# EAGLE design SimpleAmp-01 (EAGLE 4.15)
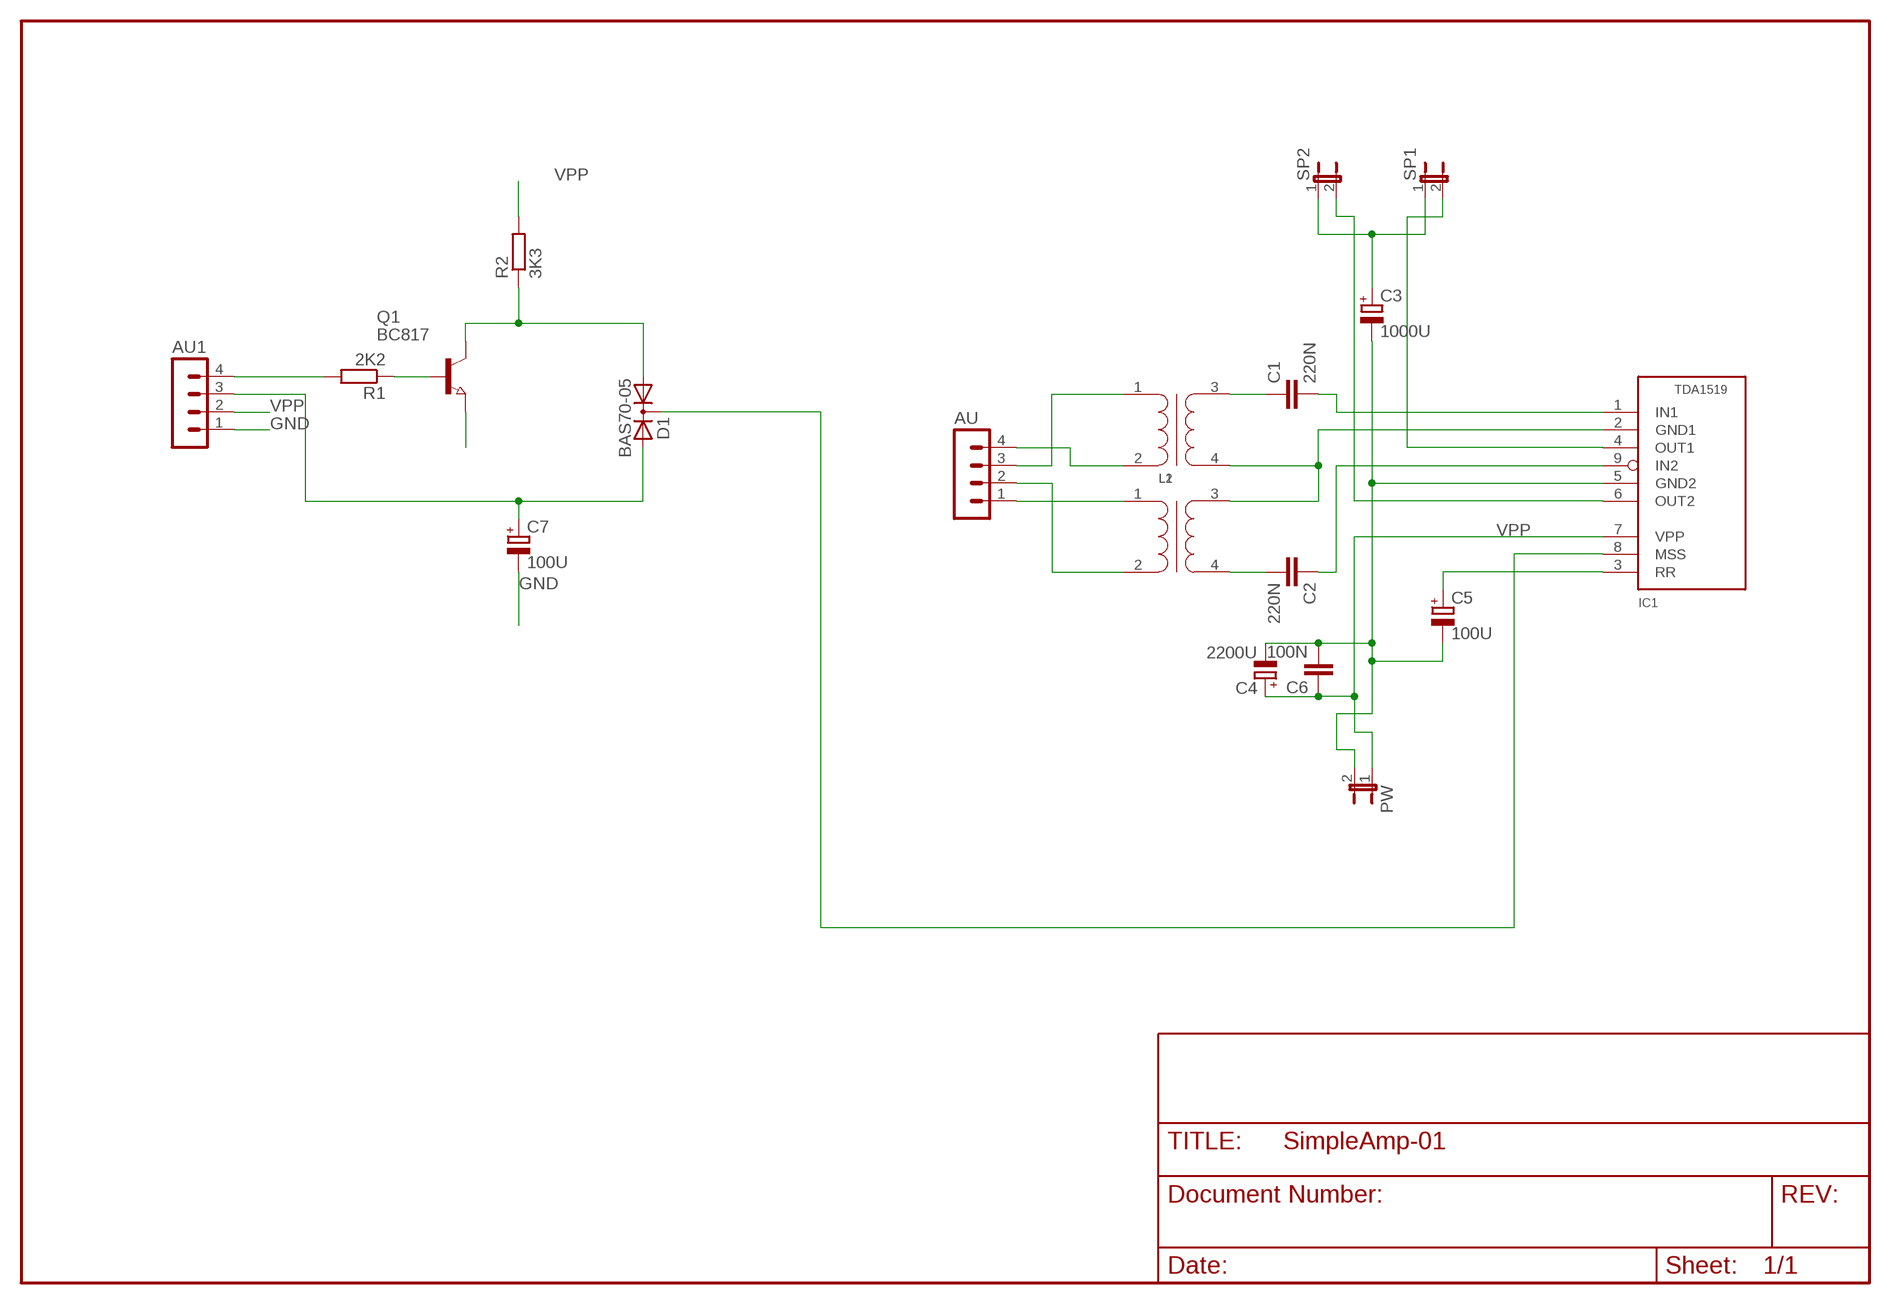
[diagram p0: schematic, sheet 1]

## Parts
AU  MA04-1  [MA04-1]
AU1  MA04-1  [MA04-1]
C1  220N  C-EU050-025X075  [C050-025X075]
C2  220N  C-EU050-025X075  [C050-025X075]
C3  1000U  CPOL-EUTT5D11  [TT5D11]
C4  2200U  CPOL-EUTT5D11  [TT5D11]
C5  100U  CPOL-EUE2.5-6  [E2,5-6]
C6  100N  C-EU025-024X044  [C025-024X044]
C7  100U  CPOL-EUSMCB  [SMC_B]
D1  BAS70-05  [SOT23]
IC1  TDA1519  [SIL09C]
L1  AUDIOUEBERTRAGER  [AUDIOUEBERTRAGER1]
L2  AUDIOUEBERTRAGER  [AUDIOUEBERTRAGER1]
PW  JP1E  [JP1]
Q1  BC817  NPN-TRANSISTOR_SOT23  [SOT23]
R1  2K2  R-EU_R0805  [R0805]
R2  3K3  R-EU_R0805  [R0805]
SP1  JP1E  [JP1]
SP2  JP1E  [JP1]

## Nets
AGND: IC1.2(GND1) L1.4 L2.3
GND: AU1.1 C3.- C4.- C5.- C6.2 C7.- IC1.5(GND2) PW.2 Q1.2(E)
MSS: D1.3(C) IC1.8(MSS)
N$1: C1.1 L1.3
N$2: AU.4 L1.2
N$3: C1.2 IC1.1(IN1)
N$4: C2.2 L2.4
N$5: C2.1 IC1.9(IN2)
N$6: AU.3 L1.1
N$7: AU.2 L2.2
N$8: AU.1 L2.1
N$9: IC1.4(OUT1) SP1.2
N$10: IC1.6(OUT2) SP2.2
N$11: C3.+ SP1.1 SP2.1
N$12: D1.1(A1) Q1.3(C) R2.1
N$13: C5.+ IC1.3(RR)
N$14: AU1.4 R1.2
N$15: AU1.3 C7.+ D1.2(A2)
N$17: Q1.1(B) R1.1
VPP: AU1.2 C4.+ C6.1 IC1.7(VPP) PW.1 R2.2

## Library data of the parts
AU AU1 = con-lstb:MA04-1: PIN HEADER
C1 C2 C6 = rcl:C-EU: CAPACITOR, European symbol
C3-C5 C7 = rcl:CPOL-EU: POLARIZED CAPACITOR, European symbol
D1 = diode:BAS70-05: Silicon Schottky Diodes General-purpose diode for high-speed switching
IC1 = turbod3:TDA1519
L1 L2 = turbod3:AUDIOUEBERTRAGER
PW SP1 SP2 = jumper:JP1E: JUMPER
Q1 = semicon-smd-ipc:NPN-TRANSISTOR_: NPN TRANSISTOR
R1 R2 = rcl:R-EU_: RESISTOR, European symbol

## Board
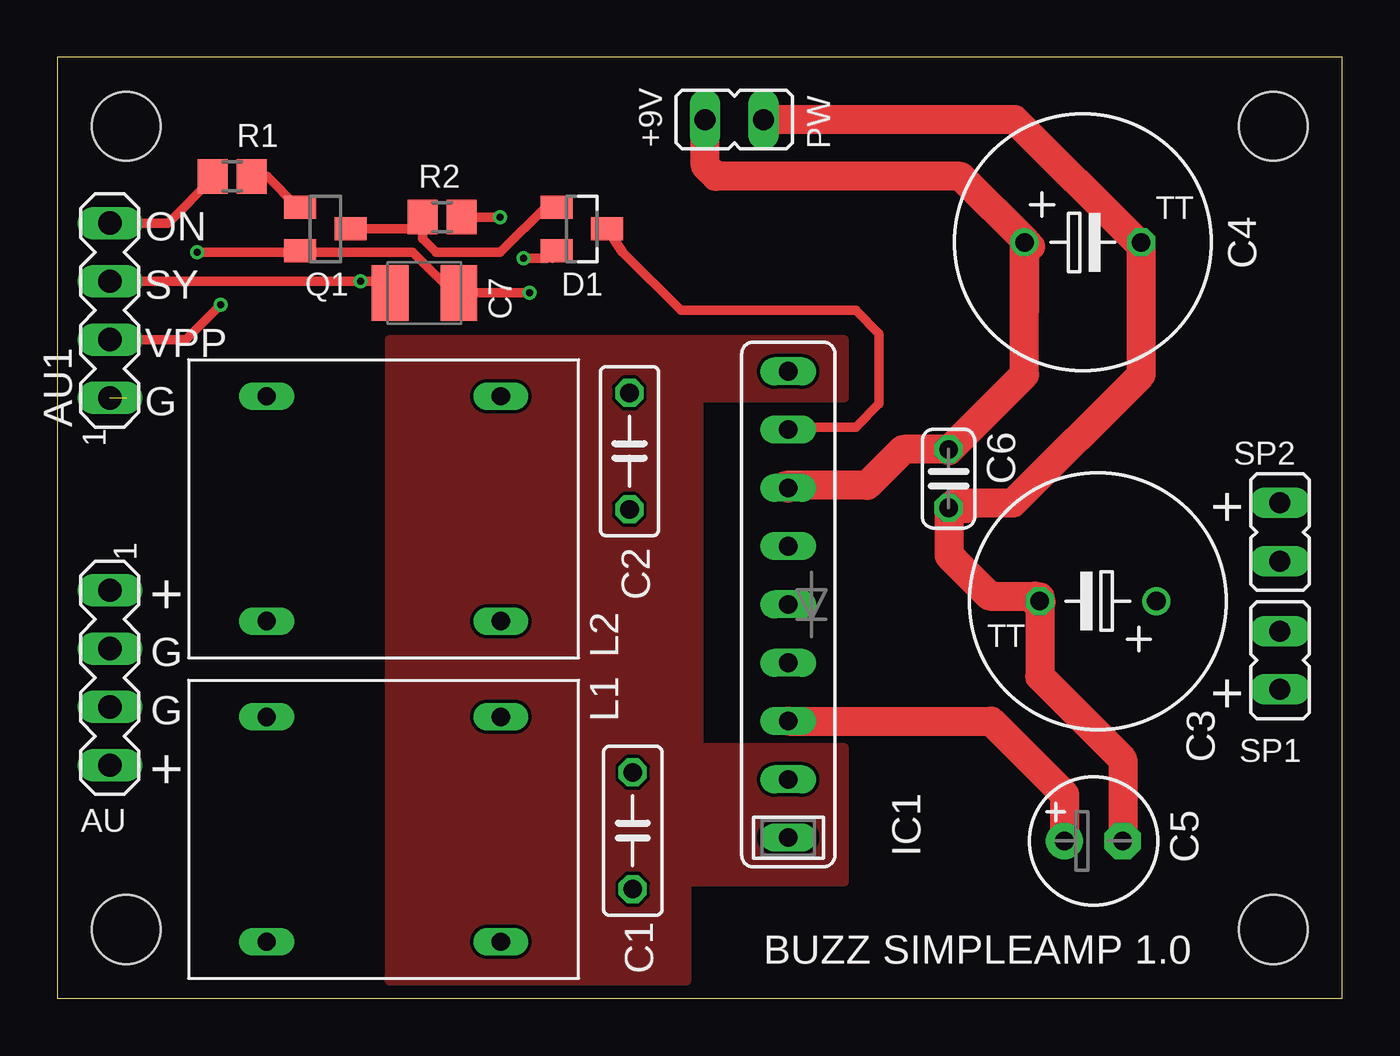
[diagram p1: board, top side]
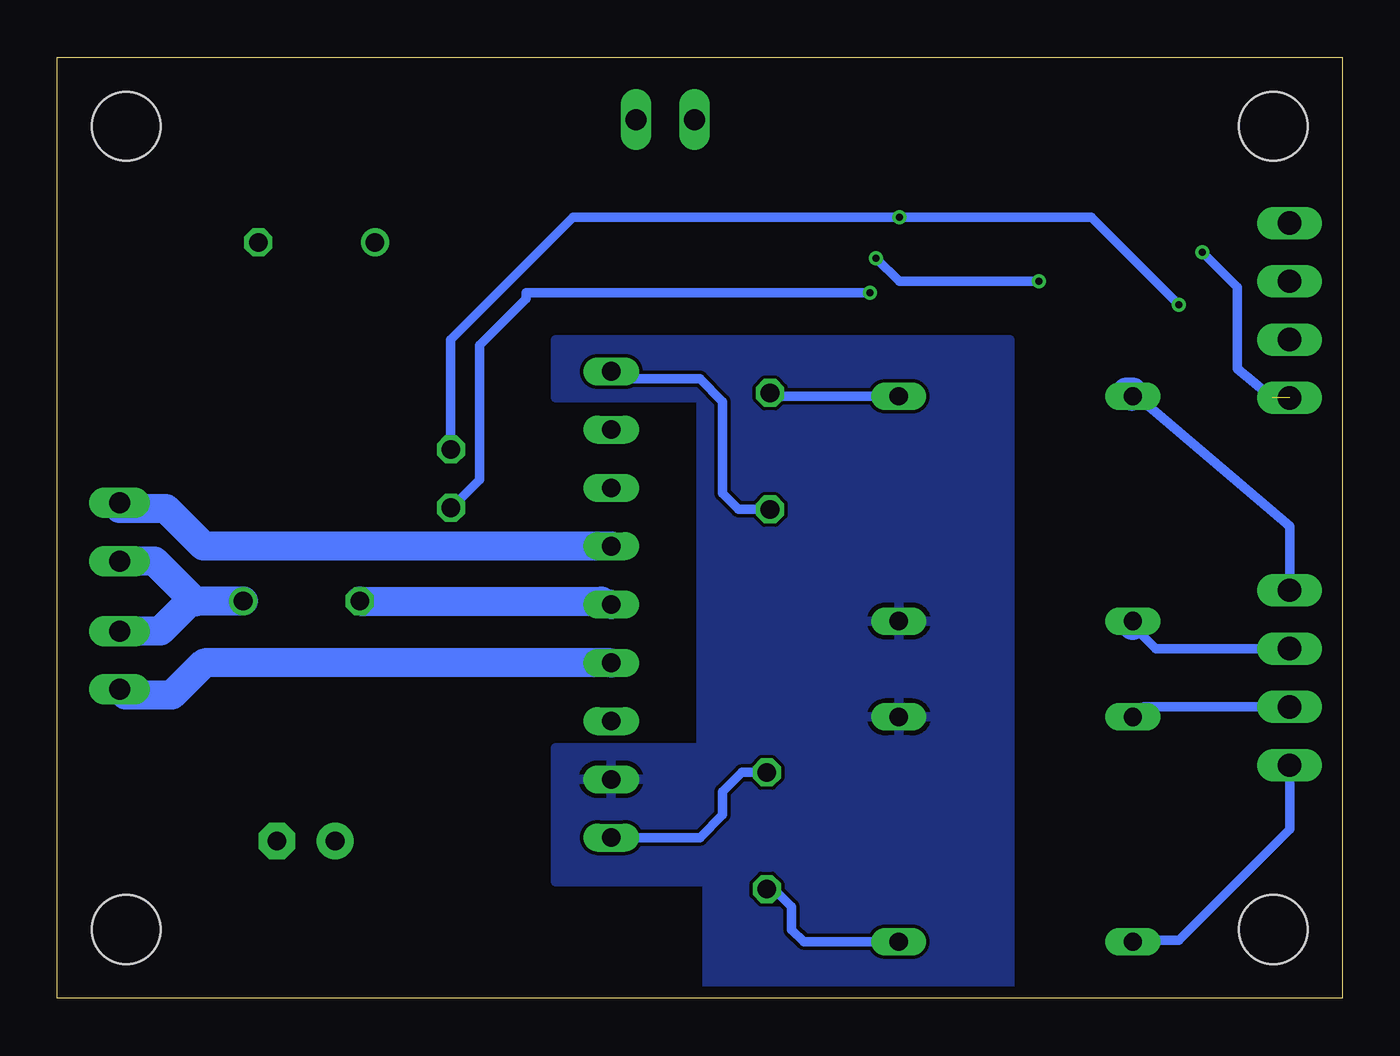
[diagram p2: board, bottom side, seen from below]

Size 56 x 41 mm. Coordinates in mm from the lower left corner, seen from the top.
Outline: 0,0 56,0 56,41 0,41 0,0
Copper layers (1*16): Top 0.035mm / dielectric 1.5mm / Bottom 0.035mm
Design rules "PCB-POOL": minimum track width 6mil, minimum drill 12mil, track to track 6mil, track to pad 6mil, pad to pad 6mil, via to via 6mil, smd to smd 6mil, copper to edge 20mil, drill to drill 8mil, minimum pad ring 8mil, minimum via ring 6mil, stop-mask expansion 3mil, vias tented up to drill 0mil, thermal gap 8mil
Holes 3 mm at 3,3 53,3 53,38 3,38

### Footprints (pad centres in the part's own frame; a part is rotated, then mirrored left to right if it is on the bottom)
MA04-1 = drill 1.016 long: 1 -3.81,0; 2 -1.27,0; 3 1.27,0; 4 3.81,0
C050-025X075 = drill 0.813 octagon: 1 -2.54,0; 2 2.54,0
TT5D11 = drill 0.813 round: + -2.54,0 | drill 0.813 octagon: - 2.54,0
E2,5-6 = drill 0.813 pad 1.6 round: + -1.27,0 | drill 0.813 pad 1.6 octagon: - 1.27,0
C025-024X044 = drill 0.813 octagon: 1 -1.27,0; 2 1.27,0
SMC_B = smd 1.6 x 2.4: + -1.5,0; - 1.5,0
SOT23 = smd 1 x 1.4: 1 -0.95,-1.1; 2 0.95,-1.1; 3 0,1.1
SIL09C = drill 0.813 long: 1 -10.16,0; 2 -7.62,0; 3 -5.08,0; 4 -2.54,0; 5 0,0; 6 2.54,0; 7 5.08,0; 8 7.62,0; 9 10.16,0
AUDIOUEBERTRAGER1 = drill 0.8 long: 1 -5.1,4.9; 2 -5.1,-4.9; 3 5.1,-4.9; 4 5.1,4.9
JP1 = drill 0.914 long: 1 0,-1.27; 2 0,1.27
R0805 = smd 1.3 x 1.5: 1 -0.85,0; 2 0.85,0

### Placement (x,y rotation side)
AU  2.29,13.97 270 top
AU1  2.29,29.97 90 top
C1  25.08,7.3 90 top
C2  24.94,23.84 90 top
C3  45.36,17.31 180 top
C4  44.7,32.94 0 top
C5  45.16,6.86 0 top
C6  38.84,22.65 270 top
C7  16,30.73 0 top
D1  22.86,33.53 270 top
IC1  31.86,17.16 90 top
L1  14.22,7.37 0 top
L2  14.22,21.34 0 top
PW  29.5,38.29 270 top
Q1  11.68,33.53 270 top
R1  7.62,35.81 180 top
R2  16.76,34.04 0 top
SP1  53.29,14.73 180 top
SP2  53.29,20.32 0 top

### Tracks (layer width: path | path; a pad name or v marks a point on that pad's centre or on a via)
AGND
  pour Bottom: 14.49,28.7 27.94,28.7 27.94,28.7 34.29,28.7 34.29,26.16 27.94,26.16 27.94,10.92 34.29,10.92 34.29,5.08 27.69,5.08 27.69,0.51 14.49,0.46
GND  (via drill 0.3)  (1 unrouted)
  Top 0.406: 10.67,32.51 10.6,32.58 Q1.2 | v6.1,32.51 10.67,32.51 | v20.57,30.73 C7.- 17.5,30.5 | 17.5,30.5 17.53,30.48 | 10.67,32.51 15.49,32.51 17.5,30.5
  Top 1.27: C3.- 42.82,14.03 46.43,10.41 C5.- | 42.66,17.31 42.62,17.27 | C3.- 42.66,17.31 | 42.66,17.31 42.84,17.49 | 42.84,17.31 42.88,17.27 | 42.84,17.31 C3.- | 42.84,17.31 42.62,17.53 40.64,17.53 38.86,19.3 38.86,21.34 | 39.62,21.34 39.61,21.35 C6.2 38.84,21.35 38.86,21.34 | 42.67,17.27 42.71,17.31 C3.- | 38.86,21.34 39.12,21.59 41.66,21.59 47.24,27.17 C4.- 47.07,32.94 41.72,38.29 PW.2
  Bottom 0.406: 3.05,26.16 4.57,27.43 4.57,30.99 v6.1,32.51 | 38.84,21.35 38.86,21.34 | 38.84,21.35 C6.2 | 38.84,21.35 37.59,22.61 37.59,28.45 35.56,30.48 35.56,30.73 v20.57,30.73
  Bottom 1.27: IC1.5 32.26,17.27 32.29,17.31 C3.-
MSS
  Top 0.406: D1.3 24.64,32.51 27.18,29.97 34.8,29.97 35.81,28.96 35.81,25.91 34.8,24.89 33.53,24.89 | IC1.8 32.26,24.89 33.53,24.89 | 33.53,24.89 33.78,24.89
N$1
  Bottom 0.406: L1.3 23.47,2.47 24,3 24,4 24.83,4.83 | 24.83,4.83 25,5 | 24.83,4.83 C1.1
N$2
  Bottom 0.406: 9.14,2.54 9.12,2.52 L1.2 9.12,2.31 | AU.4 2.29,7.37 7.11,2.54 8.89,2.54 9.12,2.31 | 9.12,2.31 9.14,2.29
N$3
  Bottom 0.406: C1.2 26.16,9.84 27,9 27,8 28,7 32,7 IC1.1
N$4
  Bottom 0.406: 25.15,26.38 25.15,26.42 | 25.15,26.38 C2.2 | L2.4 25.15,26.24 25.15,26.38
N$5
  Bottom 0.406: C2.1 26.3,21.3 27,22 27,26 28,27 32,27 31.86,27.14 IC1.9
N$6
  Bottom 0.406: 9.12,12.21 9.14,12.19 | 9.12,12.21 L1.1 | AU.3 8.64,12.7 9.12,12.21
N$7
  Bottom 0.406: 9.12,16.28 L2.2 | AU.2 8.13,15.24 9.14,16.26
  Bottom 1.27: 9.14,16.26 9.12,16.28
N$8
  Bottom 0.406: AU.1 2.29,20.57 9.14,26.42
  Bottom 1.27: L2.1 9.22,26.24 9.4,26.42 9.14,26.42
N$9
  Bottom 1.27: IC1.4 49.59,14.62 51.01,13.21 53.04,13.21 SP1.2
N$10
  Bottom 1.27: IC1.6 49.63,19.7 51.26,21.34 53.29,21.34 SP2.2
N$11
  Bottom 1.27: C3.+ 49.99,17.31 | 49.99,17.31 50.21,17.31 51.51,16 SP1.1 | SP2.1 51.77,19.05 49.99,17.27 49.99,17.31
N$12
  Top 0.406: Q1.3 15.49,33.53 16,34.04 R2.1 15.91,33.11 16.51,32.51 19.3,32.51 21.34,34.54 21.4,34.48 D1.1
N$13
  Top 1.27: IC1.3 40.7,12.08 43.89,8.89 C5.+
N$14
  Top 0.406: 2.29,33.53 AU1.4 4.83,33.78 6.86,35.81 R1.2
N$15  (via drill 0.3)
  Top 0.406: 21.59,32.26 21.84,32.51 21.78,32.58 D1.2 21.66,32.58 21.34,32.26 v20.32,32.26 | 13.97,31.24 14.48,30.73 C7.+ 13.97,31.24 | 13.97,31.24 v13.21,31.24 AU1.3
  Bottom 0.406: v13.21,31.24 19.3,31.24 v20.32,32.26
N$16
  pour Top: 14.48,28.7 34.29,28.7 34.29,27.43 34.29,26.16 27.94,26.16 27.94,10.92 34.29,10.92 34.29,5.08 27.43,5.08 27.43,0.76 14.48,0.76
N$17
  Top 0.406: Q1.1 10.48,34.48 9.14,35.81 R1.1
VPP  (via drill 0.3)
  Top 0.406: v7.11,30.23 5.59,28.7 AU1.2 | 17.53,34.04 R2.2 v19.3,34.04
  Top 1.27: IC1.7 31.75,22.35 35.31,22.35 36.87,23.92 C6.1 38.84,23.89 38.86,23.88 42.16,27.17 C4.+ | C4.+ 42.16,29.97 | PW.1 28.23,36.28 28.7,35.81 39.37,35.81 42.25,32.94 | 42.25,32.94 42.42,32.77 | C4.+ 42.25,32.94
  Bottom 0.406: v7.11,30.23 10.92,34.04 v19.3,34.04 33.53,34.04 38.86,28.7 38.86,23.88 38.84,23.89 C6.1

### Text on the board
tNames: +9V | ON | SY | VPP | G | + | + | G | G | + | + | BUZZ SIMPLEAMP 1.0